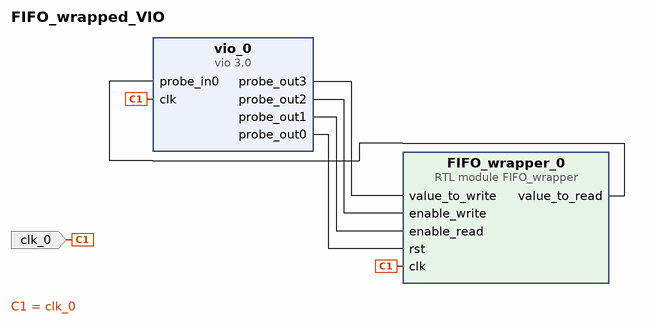
[diagram p0: block diagram of the top level]
# Vivado block design FIFO_wrapped_VIO, xc7a35ticsg324-1L, Vivado 2019.1
create_bd_design FIFO_wrapped_VIO

create_bd_port -dir I -type clk clk_0

create_bd_cell -type module -reference FIFO_wrapper FIFO_wrapper_0
create_bd_cell -type ip -vlnv xilinx.com:ip:vio:3.0 vio_0
set_property -dict {CONFIG.C_NUM_PROBE_OUT 4 CONFIG.C_PROBE_OUT3_WIDTH 32 CONFIG.C_PROBE_OUT4_WIDTH 32} [get_bd_cells vio_0]

# ---- connections ----

connect_bd_net [get_bd_pins vio_0/probe_out3] [get_bd_pins FIFO_wrapper_0/value_to_write]
connect_bd_net [get_bd_pins vio_0/probe_out2] [get_bd_pins FIFO_wrapper_0/enable_write]
connect_bd_net [get_bd_pins vio_0/probe_out1] [get_bd_pins FIFO_wrapper_0/enable_read]
connect_bd_net [get_bd_pins vio_0/probe_out0] [get_bd_pins FIFO_wrapper_0/rst]
connect_bd_net [get_bd_pins FIFO_wrapper_0/value_to_read] [get_bd_pins vio_0/probe_in0]
connect_bd_net -net clk_0_1 [get_bd_ports clk_0] [get_bd_pins vio_0/clk] [get_bd_pins FIFO_wrapper_0/clk]

validate_bd_design
save_bd_design
